# Altium schematic sheet HallConnector.SchDoc
size A; SheetNumber: 4; SheetTotal: 9
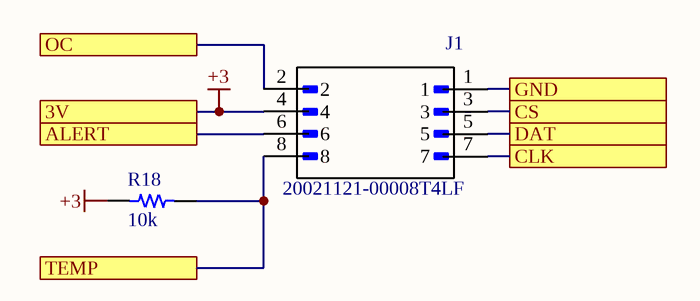
[diagram p0: HallConnector.SchDoc]

## Parts
J1  20021121-00008T4LF  [*AMPHENOL_20021121-00008T4LF]
R18  10k  [RES 0402_1005]

## Ports
3V, ALERT, CLK, CS, DAT, GND, OC, TEMP

## Nets
+3: J1.4 R18.1 ; port 3V
ALERT: J1.6 ; port ALERT
CLK: J1.7 ; port CLK
CS: J1.3 ; port CS
DAT: J1.5 ; port DAT
GND: J1.1 ; port GND
OC: J1.2 ; port OC
TEMP: J1.8 R18.2 ; port TEMP

## Library data of the parts
R18 = RP73PF1E249KBTD: RES 249K OHM 0.1% 1/10W 0402; Manufacturer: TE Connectivity Passive Product; Value: 249 kOhms; Power (Watts): 0.1W, 1/10W; Temperature Coefficient: ±25ppm/°C; Part Number: RP73PF1E249KBTD; ComponentLink1Description: Datasheet; ComponentLink1URL: https://www.te.com/commerce/DocumentDelivery/DDEController?Action=srchrtrv&DocNm=1773272&DocType=DS&DocLang=English; ComponentLink2Description: DigiKey Link; ComponentLink2URL: https://www.digikey.com/en/products/detail/te-connectivity-passive-product/RP73PF1E249KBTD/8261091; Composition: Thin Film; Device Package: 0402 (1005 Metric); Height - Seated (Max): 0.014" (0.35mm); LastUpdated: 2/9/2024 8:30:24 PM; Lifecycle Status: Active; Minimum Order: 1; Number of Terminations: 2; Operating Temperature: -55°C ~ 155°C; Package / Case: 0402 (1005 Metric); Packaging: TapeAndReel; PartId: 2418; Part Status: Active; Price: 0.07; Resistance: 249 kOhms; Series: RP73, Holsworthy; Size / Dimension: 0.039" L x 0.020" W (1.00mm x 0.50mm); Supplier 1: DigiKey; Supplier Part Number 1: A127549CT-ND; Supplier Device Package: 0402; Tolerance: ±0.1%
J1 = 20021121-00008T4LF: Value: *